# Altium schematic sheet [07] - CPU CONNECTORS .SchDoc (part 1 of 2)
size A2; Organization: Altium Limited; Address1: L3, 12a Rodborough Rd; Address2: Frenchs Forest; Address3: NSW; Address4: Australia 2086; DocumentNumber: 7; SheetNumber: 7; SheetTotal: 11
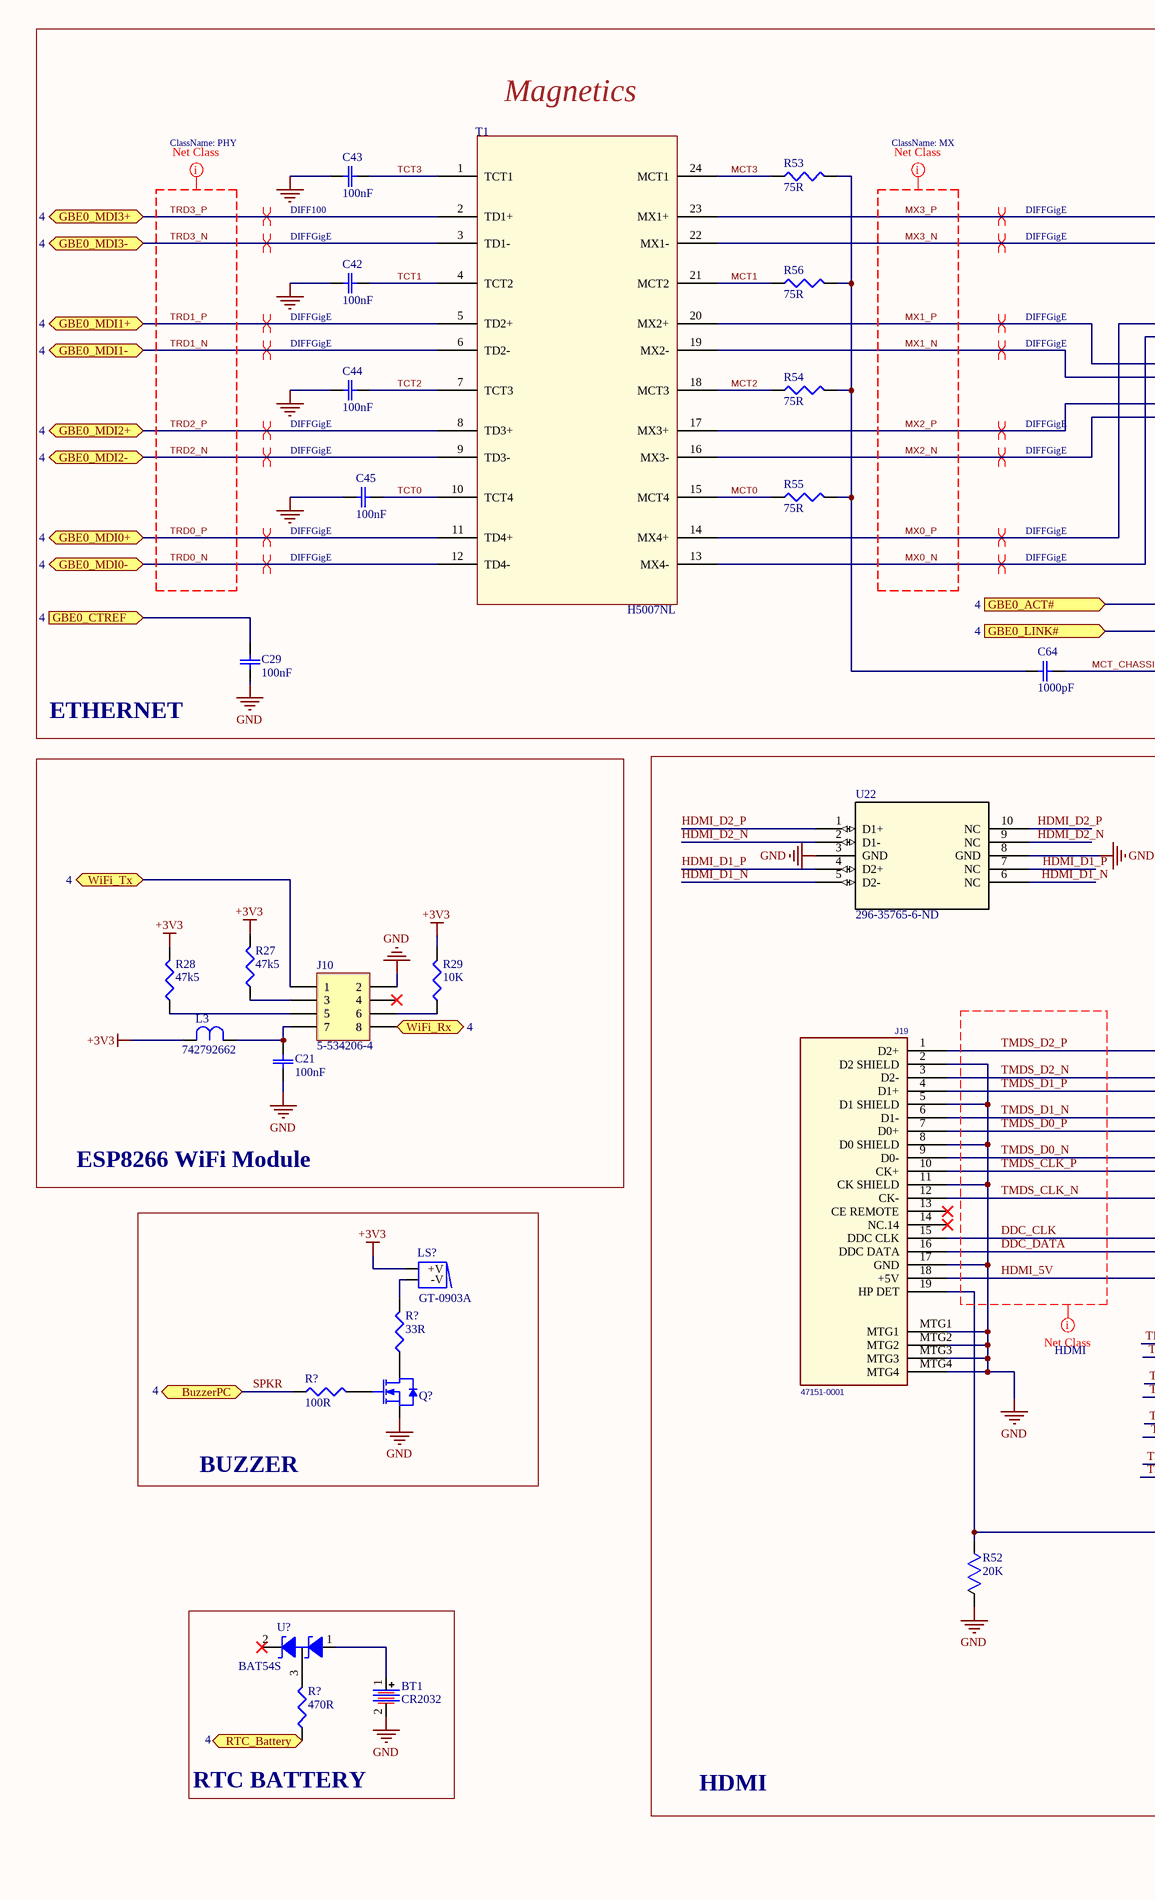
[diagram p0: [07] - CPU CONNECTORS .SchDoc, left]
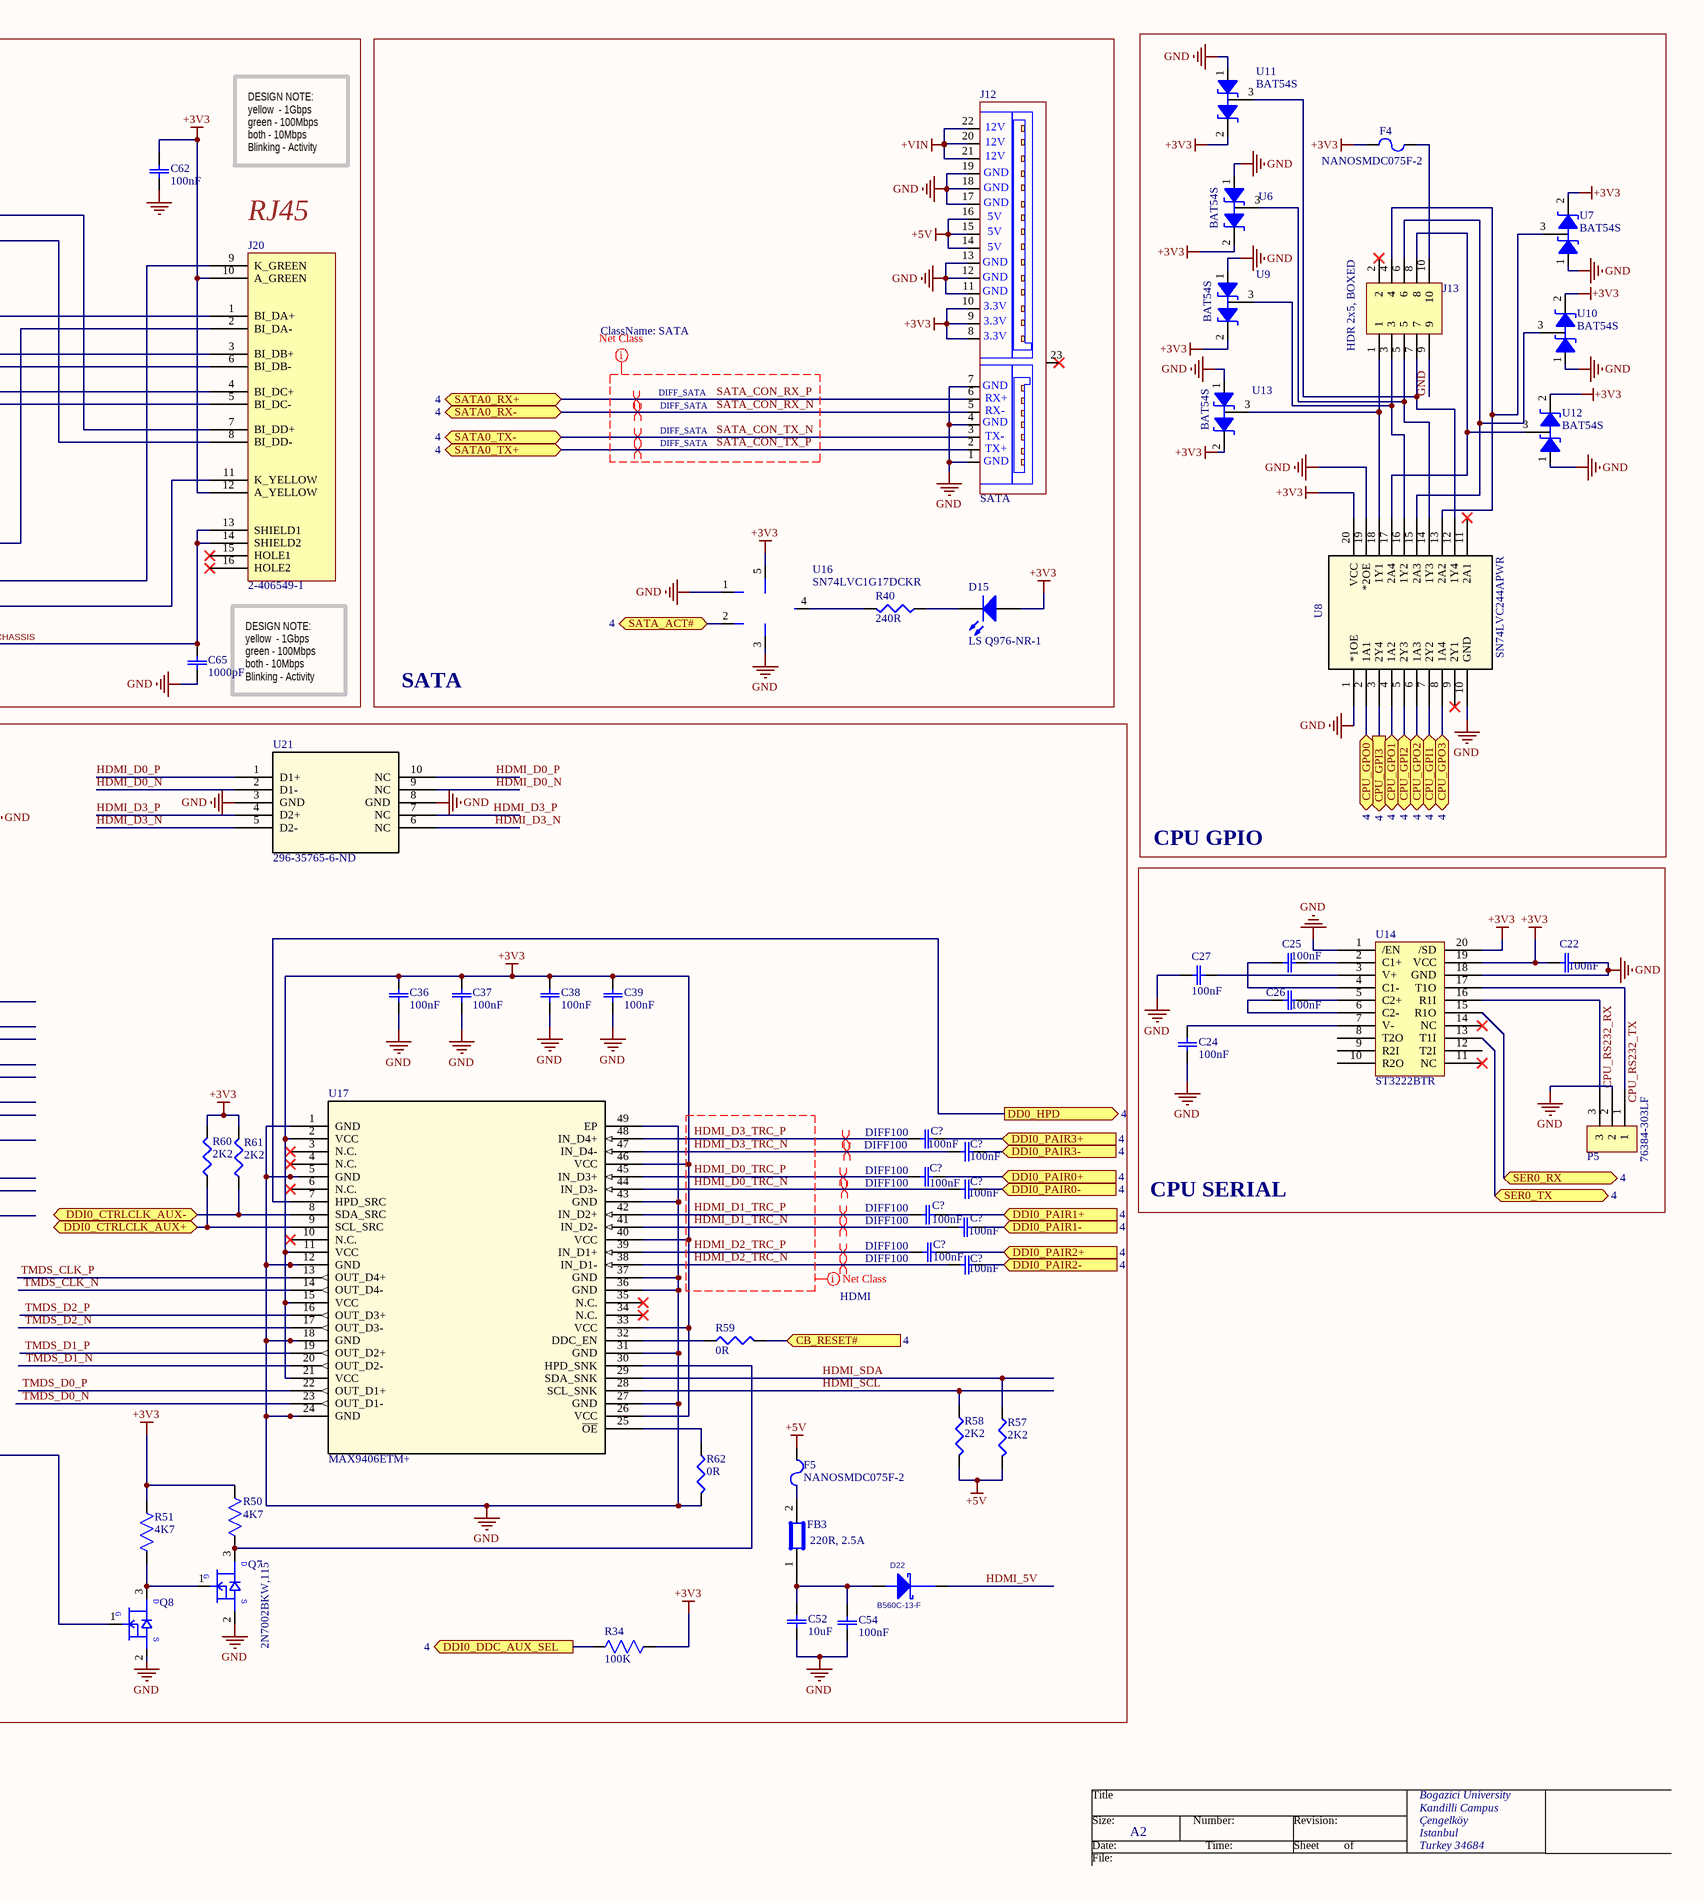
[diagram p1: [07] - CPU CONNECTORS .SchDoc, right]

## Parts
(Parts that share a designator on the sheet are numbered #1, #2 ... from top to bottom, then left to right.)
BT1  CR2032  [BS-7]
C21  100nF  [C0402]
C22  100nF  [C0402]
C24  100nF  [C0402]
C25  100nF  [C0402]
C26  100nF  [C0402]
C27  100nF  [C0402]
C29  100nF  [C0402]
C36  100nF  [C0402]
C37  100nF  [C0402]
C38  100nF  [C0402]
C39  100nF  [C0402]
C42  100nF  [C0402]
C43  100nF  [C0402]
C44  100nF  [C0402]
C45  100nF  [C0402]
C52  10uF  [CAP_3216]
C54  100nF  [C0402]
C62  100nF  [C0402]
C64  1000pF  [C1206]
C65  1000pF  [C1206]
C?#1  100nF  [CAP_1608]
C?#2  100nF  [CAP_1608]
C?#3  100nF  [CAP_1608]
C?#4  100nF  [CAP_1608]
C?#5  100nF  [CAP_1608]
C?#6  100nF  [CAP_1608]
C?#7  100nF  [CAP_1608]
C?#8  100nF  [CAP_1608]
D15  LS Q976-NR-1  [D0603_Directional]
D22  B560C-13-F  [SMC]
F4  NANOSMDC075F-2  [FUS_NANO_TYCO]
F5  NANOSMDC075F-2  [FUS_NANO_TYCO]
FB3  220R, 2.5A  [C0603]
J10  5-534206-4  [ESP8266_WSOC]
J12  SATA  [SATA_Recepticle]
J13  HDR 2x5, BOXED  [HDR_2X5_2.54MM_BOXED]
J19  47151-0001  [HDMI]
J20  2-406549-1  [RJ45LED]
L3  742792662  [IND_1608-M]
LS?  GT-0903A  [GT-0903A]
P5  76384-303LF  [HDR_1X3_2.54MM_SHDR_V2]
Q7  2N7002BKW,115  [SC70_SOT323]
Q8  2N7002BKW,115  [SC70_SOT323]  (value not drawn)
Q?  MOSFET N-CH 20V 1A SOT323  [SC70_SOT323]  (value not drawn)
R27  47k5  [R0402]
R28  47k5  [R0402]
R29  10K  [R0402]
R34  100K  [STA_RNCP0805-M]
R40  240R  [R0402]
R50  4K7  [RES0805_CRG_TYCO]
R51  4K7  [RES0805_CRG_TYCO]
R52  20K  [STA_RNCP0805]
R53  75R  [R0402]
R54  75R  [R0402]
R55  75R  [R0402]
R56  75R  [R0402]
R57  2K2  [R0402]
R58  2K2  [R0402]
R59  0R  [R0402]
R60  2K2  [R0402]
R61  2K2  [R0402]
R62  0R  [R0402]
R?#1  33R  [R0402]
R?#2  100R  [R0402]
R?#3  470R  [R0402]
T1  H5007NL  [H5007NL]
U6  BAT54S  [SOT-23]
U7  BAT54S  [SOT-23]
U8  SN74LVC244APWR  [PW20]
U9  BAT54S  [SOT-23]
U10  BAT54S  [SOT-23]
U11  BAT54S  [SOT-23]
U12  BAT54S  [SOT-23]
U13  BAT54S  [SOT-23]
U14  ST3222BTR  [TSSOP20]
U16  SN74LVC1G17DCKR  [DCK5]
U17  MAX9406ETM+  [21-0144H_T4877-6]
U21  296-35765-6-ND  [DQA10]
U22  296-35765-6-ND  [DQA10]
U?  BAT54S  [SOT-23]

## Blocks framed on the sheet
SATA: D15 J12 R40 U16
CPU GPIO: F4 J13 U6-U13
ESP8266 WiFi Module: C21 J10 L3 R27-R29
HDMI: C36-C39 C52 C54 C?#1-C?#8 D22 F5 FB3 J19 Q7 Q8 R34 R50-R52 R57-R62 U17 U21 U22
BUZZER: LS? Q? R?#1 R?#2
RTC BATTERY: BT1 R?#3 U?

## Ports
BuzzerPC (bidir, see 4), CB_RESET# (in, see 4), CPU_GPI1 (bidir, see 4), CPU_GPI2 (bidir, see 4), CPU_GPI3 (out, see 4), CPU_GPO0 (bidir, see 4), CPU_GPO1 (bidir, see 4), CPU_GPO2 (bidir, see 4), CPU_GPO3 (bidir, see 4), DD0_HPD (out, see 4), DDI0_CTRLCLK_AUX+ (bidir), DDI0_CTRLCLK_AUX- (bidir), DDI0_DDC_AUX_SEL (out, see 4), DDI0_PAIR0+ (in, see 4), DDI0_PAIR0- (in, see 4), DDI0_PAIR1+ (in, see 4), DDI0_PAIR1- (in, see 4), DDI0_PAIR2+ (in, see 4), DDI0_PAIR2- (in, see 4), DDI0_PAIR3+ (in, see 4), DDI0_PAIR3- (in, see 4), GBE0_ACT# (in, see 4), GBE0_CTREF (in, see 4), GBE0_LINK# (in, see 4), GBE0_MDI0+ (bidir, see 4), GBE0_MDI0- (bidir, see 4), GBE0_MDI1+ (bidir, see 4), GBE0_MDI1- (bidir, see 4), GBE0_MDI2+ (bidir, see 4), GBE0_MDI2- (bidir, see 4), GBE0_MDI3+ (bidir, see 4), GBE0_MDI3- (bidir, see 4), RTC_Battery (bidir, see 4), SATA0_RX+ (bidir, see 4), SATA0_RX- (bidir, see 4), SATA0_TX+ (bidir, see 4), SATA0_TX- (bidir, see 4), SATA_ACT# (bidir, see 4), SER0_RX (bidir, see 4), SER0_TX (bidir, see 4), WiFi_Rx (bidir, see 4), WiFi_Tx (bidir, see 4)

## Nets
+3V3: C22.2 C36.2 C37.2 C38.2 C39.2 C62.2 D15.1(A) F4.2 J12.8 J12.9 J12.10 J20.10(A_GREEN) J20.12(A_YELLOW) L3.2 LS?.1(+V) R27.2 R28.2 R29.2 R34.1 R50.1 R51.1 R60.2 R61.2 U6.2 U7.2 U8.20(VCC) U9.2 U10.2 U11.2 U12.2 U13.2 U14.19(VCC) U14.20(/SD) U16.5(VCC) U17.2(VCC) U17.11(VCC) U17.15(VCC) U17.21(VCC) U17.26(VCC) U17.33(VCC) U17.40(VCC) U17.46(VCC)
+5V: F5.2 J12.14 J12.15 J12.16 R57.2 R58.2
+VIN: J12.20 J12.21 J12.22
GND: BT1.2 C21.1 C22.1 C24.1 C27.1 C29.1 C36.1 C37.1 C38.1 C39.1 C42.1 C43.1 C44.1 C45.1 C52.1 C54.1 C62.1 C65.2 J10.2 J12.1 J12.4 J12.7 J12.11 J12.12 J12.13 J12.17 J12.18 J12.19 J13.9 J19.2(D2_SHIELD) J19.5(D1_SHIELD) J19.8(D0_SHIELD) J19.11(CK_SHIELD) J19.17(GND) J19.MTG1 J19.MTG2 J19.MTG3 J19.MTG4 P5.2 Q7.2(SOURCE) Q8.2(SOURCE) Q?.2(S) R52.2 R62.2 U6.1 U7.1 U8.1(*1OE) U8.10(GND) U8.19(*2OE) U9.1 U10.1 U11.1 U12.1 U13.1 U14.1(/EN) U14.18(GND) U16.1(NC) U16.3(GND) U17.1(GND) U17.5(GND) U17.12(GND) U17.18(GND) U17.24(GND) U17.27(GND) U17.31(GND) U17.36(GND) U17.37(GND) U17.43(GND) U17.49(EP) U21.3(GND) U21.8(GND) U22.3(GND) U22.8(GND)
CB_RESET#: R59.2 ; port CB_RESET#
CPU_GPI1: U8.7(2Y2) ; port CPU_GPI1
CPU_GPI2: U8.5(2Y3) ; port CPU_GPI2
CPU_GPI3: U8.3(2Y4) ; port CPU_GPI3
CPU_GPO0: U8.2(1A1) ; port CPU_GPO0
CPU_GPO1: U8.4(1A2) ; port CPU_GPO1
CPU_GPO2: U8.6(1A3) ; port CPU_GPO2
CPU_GPO3: U8.8(1A4) ; port CPU_GPO3
CPU_RS232_RX: P5.3 U14.16(R1I)
CPU_RS232_TX: P5.1 U14.17(T1O)
DD0_HPD: U17.7(HPD_SRC) ; port DD0_HPD
DDC_CLK: J19.15(DDC_CLK)
DDC_DATA: J19.16(DDC_DATA)
DDI0_CTRLCLK_AUX+: R60.1 U17.9(SCL_SRC) ; port DDI0_CTRLCLK_AUX+
DDI0_CTRLCLK_AUX-: R61.1 U17.8(SDA_SRC) ; port DDI0_CTRLCLK_AUX-
DDI0_DDC_AUX_SEL: R34.2 ; port DDI0_DDC_AUX_SEL
DDI0_PAIR0+: C?#3.2 ; port DDI0_PAIR0+
DDI0_PAIR0-: C?#4.2 ; port DDI0_PAIR0-
DDI0_PAIR1+: C?#5.2 ; port DDI0_PAIR1+
DDI0_PAIR1-: C?#6.2 ; port DDI0_PAIR1-
DDI0_PAIR2+: C?#7.2 ; port DDI0_PAIR2+
DDI0_PAIR2-: C?#8.2 ; port DDI0_PAIR2-
DDI0_PAIR3+: C?#1.2 ; port DDI0_PAIR3+
DDI0_PAIR3-: C?#2.2 ; port DDI0_PAIR3-
GBE0_ACT#: J20.9(K_GREEN) ; port GBE0_ACT#
GBE0_CTREF: C29.2 ; port GBE0_CTREF
GBE0_LINK#: J20.11(K_YELLOW) ; port GBE0_LINK#
HDMI_5V: D22.1(cathode) J19.18(+5V)
HDMI_D0_N: U21.2(D1-) U21.9(NC)
HDMI_D0_P: U21.1(D1+) U21.10(NC)
HDMI_D0_TRC_N: C?#4.1 U17.44(IN_D3-)
HDMI_D0_TRC_P: C?#3.1 U17.45(IN_D3+)
HDMI_D1_N: U22.5(D2-) U22.6(NC)
HDMI_D1_P: U22.4(D2+) U22.7(NC)
HDMI_D1_TRC_N: C?#6.1 U17.41(IN_D2-)
HDMI_D1_TRC_P: C?#5.1 U17.42(IN_D2+)
HDMI_D2_N: U22.2(D1-) U22.9(NC)
HDMI_D2_P: U22.1(D1+) U22.10(NC)
HDMI_D2_TRC_N: C?#8.1 U17.38(IN_D1-)
HDMI_D2_TRC_P: C?#7.1 U17.39(IN_D1+)
HDMI_D3_N: U21.5(D2-) U21.6(NC)
HDMI_D3_P: U21.4(D2+) U21.7(NC)
HDMI_D3_TRC_N: C?#2.1 U17.47(IN_D4-)
HDMI_D3_TRC_P: C?#1.1 U17.48(IN_D4+)
HDMI_SCL: R58.1 U17.28(SCL_SNK)
HDMI_SDA: R57.1 U17.29(SDA_SNK)
MCT0: R55.1 T1.15(MCT4)
MCT1: R56.1 T1.21(MCT2)
MCT2: R54.1 T1.18(MCT3)
MCT3: R53.1 T1.24(MCT1)
MCT_CHASSIS: C64.1 C65.1 J20.13(SHIELD1) J20.14(SHIELD2)
MX0_N: J20.2(BI_DA-) T1.13(MX4-)
MX0_P: J20.1(BI_DA+) T1.14(MX4+)
MX1_N: J20.6(BI_DB-) T1.19(MX2-)
MX1_P: J20.3(BI_DB+) T1.20(MX2+)
MX2_N: J20.5(BI_DC-) T1.16(MX3-)
MX2_P: J20.4(BI_DC+) T1.17(MX3+)
MX3_N: J20.8(BI_DD-) T1.22(MX1-)
MX3_P: J20.7(BI_DD+) T1.23(MX1+)
RTC_Battery: R?#3.1 ; port RTC_Battery
SATA_ACT#: U16.2(A) ; port SATA_ACT#
SATA_CON_RX_N: J12.5 ; port SATA0_RX-
SATA_CON_RX_P: J12.6 ; port SATA0_RX+
SATA_CON_TX_N: J12.3 ; port SATA0_TX-
SATA_CON_TX_P: J12.2 ; port SATA0_TX+
SER0_RX: U14.15(R1O) ; port SER0_RX
SER0_TX: U14.13(T1I) ; port SER0_TX
SPKR: R?#2.1 ; port BuzzerPC
TCT0: C45.2 T1.10(TCT4)
TCT1: C42.2 T1.4(TCT2)
TCT2: C44.2 T1.7(TCT3)
TCT3: C43.2 T1.1(TCT1)
TMDS_CLK_N: J19.12(CK-) U17.14(OUT_D4-)
TMDS_CLK_P: J19.10(CK+) U17.13(OUT_D4+)
TMDS_D0_N: J19.9(D0-) U17.23(OUT_D1-)
TMDS_D0_P: J19.7(D0+) U17.22(OUT_D1+)
TMDS_D1_N: J19.6(D1-) U17.20(OUT_D2-)
TMDS_D1_P: J19.4(D1+) U17.19(OUT_D2+)
TMDS_D2_N: J19.3(D2-) U17.17(OUT_D3-)
TMDS_D2_P: J19.1(D2+) U17.16(OUT_D3+)
TRD0_N: T1.12(TD4-) ; port GBE0_MDI0-
TRD0_P: T1.11(TD4+) ; port GBE0_MDI0+
TRD1_N: T1.6(TD2-) ; port GBE0_MDI1-
TRD1_P: T1.5(TD2+) ; port GBE0_MDI1+
TRD2_N: T1.9(TD3-) ; port GBE0_MDI2-
TRD2_P: T1.8(TD3+) ; port GBE0_MDI2+
TRD3_N: T1.3(TD1-) ; port GBE0_MDI3-
TRD3_P: T1.2(TD1+) ; port GBE0_MDI3+
WiFi_Rx: J10.8 ; port WiFi_Rx
WiFi_Tx: J10.1 ; port WiFi_Tx
NetBT1_1: BT1.1 U?.1
NetC21_2: C21.2 J10.7 L3.1
NetC24_2: C24.2 U14.7(V-)
NetC25_1: C25.1 U14.2(C1+)
NetC25_2: C25.2 U14.4(C1-)
NetC26_1: C26.1 U14.5(C2+)
NetC26_2: C26.2 U14.6(C2-)
NetC27_2: C27.2 U14.3(V+)
NetC52_2: C52.2 C54.2 D22.2(ANODE) FB3.1
NetC64_2: C64.2 R53.2 R54.2 R55.2 R56.2
NetD15_2: D15.2(K) R40.1
NetF4_1: F4.1 J13.10
NetF5_1: F5.1 FB3.2
NetJ10_3: J10.3 R27.1
NetJ10_5: J10.5 R28.1
NetJ10_6: J10.6 R29.1
NetJ13_1: J13.1 U8.18(1Y1) U13.3
NetJ13_3: J13.3 U8.16(1Y2) U9.3
NetJ13_4: J13.4 U7.3 U8.13(2A2)
NetJ13_5: J13.5 U6.3 U8.14(1Y3)
NetJ13_6: J13.6 U8.15(2A3) U10.3
NetJ13_7: J13.7 U8.12(1Y4) U11.3
NetJ13_8: J13.8 U8.17(2A4) U12.3
NetJ19_19: J19.19(HP_DET) Q8.1(GATE) R52.1
NetLS?_2: LS?.2(-V) R?#1.2
NetQ7_1: Q7.1(GATE) Q8.3(DRAIN) R51.2
NetQ7_3: Q7.3(DRAIN) R50.2 U17.30(HPD_SNK)
NetQ?_1: Q?.1(G) R?#2.2
NetQ?_3: Q?.3(D) R?#1.1
NetR40_2: R40.2 U16.4(Y)
NetR59_1: R59.1 U17.32(DDC_EN)
NetR62_1: R62.1 U17.25(~{OE})
NetR?#3_2: R?#3.2 U?.3

Not connected (* = marked no-connect by the designer): J10 4*; J12 23*; J13 2*; J19 13(CE_REMOTE)* 14(NC.14)*; J20 15(HOLE1)* 16(HOLE2)*; U8 9(2Y1)* 11(2A1)*; U14 8(T2O) 9(R2I) 10(R2O) 11(NC)* 12(T2I) 14(NC)*; U17 3(N.C.)* 4(N.C.)* 6(N.C.)* 10(N.C.)* 34(N.C.)* 35(N.C.)*; U? 2*

## Layout directives
differential pair; net class DIFF100: HDMI_D0_TRC_N, HDMI_D0_TRC_P, HDMI_D1_TRC_N, HDMI_D1_TRC_P, HDMI_D2_TRC_N, HDMI_D2_TRC_P, HDMI_D3_TRC_N, HDMI_D3_TRC_P, TRD3_P
differential pair; net class DIFFGigE: MX0_N, MX0_P, MX1_N, MX1_P, MX2_N, MX2_P, MX3_N, MX3_P, TRD0_N, TRD0_P, TRD1_N, TRD1_P, TRD2_N, TRD2_P, TRD3_N
net class PHY: TRD0_N, TRD0_P, TRD1_N, TRD1_P, TRD2_N, TRD2_P, TRD3_N, TRD3_P
net class MX: MX0_N, MX0_P, MX1_N, MX1_P, MX2_N, MX2_P, MX3_N, MX3_P
differential pair; net class DIFF_SATA: SATA_CON_RX_N, SATA_CON_RX_P, SATA_CON_TX_N, SATA_CON_TX_P
net class SATA: SATA_CON_RX_N, SATA_CON_RX_P, SATA_CON_TX_N, SATA_CON_TX_P
net class HDMI: DDC_CLK, DDC_DATA, HDMI_5V, HDMI_D0_TRC_N, HDMI_D0_TRC_P, HDMI_D1_TRC_N, HDMI_D1_TRC_P, HDMI_D2_TRC_N, HDMI_D2_TRC_P, HDMI_D3_TRC_N, HDMI_D3_TRC_P, TMDS_CLK_N, TMDS_CLK_P, TMDS_D0_N, TMDS_D0_P, TMDS_D1_N, TMDS_D1_P, TMDS_D2_N, TMDS_D2_P

## Notes on the sheet
- Magnetics
- DESIGN NOTE:
  yellow  - 1Gbps
  green - 100Mbps
  both - 10Mbps
  Blinking - Activity
- (near J20) RJ45
- ETHERNET
- CPU SERIAL
- Title
- Bogazici University
- Size:
- Date:
- File:
- A2
- Number:
- Time:
- Revision:
- Sheet
- of
- Kandilli Campus
- Çengelköy
- Istanbul
- Turkey 34684
- (in symbol 2N7002BKW,115) D; G; S
- (in symbol SATA) 12V; GND; 5V; 3.3V; RX+; RX-; TX-; TX+